# EAGLE design Adafruit DS3231 RTC Breakout (EAGLE 6.6.0)
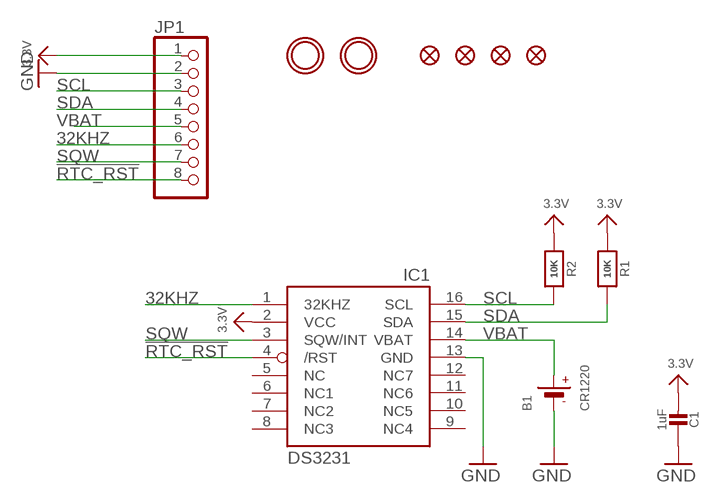
[diagram p0: schematic, sheet 1]

## Parts
B1  CR1220  BATTERYCR1220_SMT  [CR1220]
C1  1uF  CAP_CERAMIC0805-NOOUTLINE  [0805-NO]
FID1  FIDUCIAL""  [FIDUCIAL_1MM]
FID2  FIDUCIAL""  [FIDUCIAL_1MM]
FID3  FIDUCIAL""  [FIDUCIAL_1MM]
FID4  FIDUCIAL""  [FIDUCIAL_1MM]
IC1  DS3231/SO  [SO16W]
JP1  HEADER-1X870MIL  [1X08_ROUND_70]
R1  10K  RESISTOR0805_NOOUTLINE  [0805-NO]
R2  10K  RESISTOR0805_NOOUTLINE  [0805-NO]
U$6  MOUNTINGHOLE2.5  [MOUNTINGHOLE_2.5_PLATED]
U$7  MOUNTINGHOLE2.5  [MOUNTINGHOLE_2.5_PLATED]

## Nets
3.3V: C1.2 IC1.2(VCC) JP1.1 R1.1 R2.1
32KHZ: IC1.1(32KHZ) JP1.6
!RTC_RST: IC1.4(/RST) JP1.8
GND: B1.- C1.1 IC1.13(GND) JP1.2
SCL: IC1.16(SCL) JP1.3 R2.2
SDA: IC1.15(SDA) JP1.4 R1.2
SQW: IC1.3(SQW/INT) JP1.7
VBAT: B1.+$1(+) IC1.14(VBAT) JP1.5
Unconnected: IC1.5(NC) IC1.6(NC1) IC1.7(NC2) IC1.8(NC3) IC1.9(NC4) IC1.10(NC5) IC1.11(NC6) IC1.12(NC7)

## Library data of the parts
B1 = microbuilder:BATTERY: CR1220 SMT - Digikey: 3001K-ND CD2032 BAT-HLD-001 - Digikey: BAT-HLD-001-ND
C1 = microbuilder:CAP_CERAMIC: Ceramic Capacitors For new designs, use the packages preceded by an '_' character since they are more reliable: The following footprints should be used on most boards: _0402 - Standard footprint for regular board layouts _0603 - Standard footprint for regular board layouts _0805 - Standard footprint for regular board layouts _1206 - Standard footprint for regular board layouts For extremely tight-pitch boards where space is at a premium, the following 'micro-pitch' footprints can be used (smaller pads, no silkscreen outline, etc.): _0402MP - Micro-pitch footprint for very dense/compact boards _0603MP - Micro-pitch footprint for very dense/compact boards _0805MP - Micro-pitch footprint for very dense/compact boards _1206MP - Micro-pitch footprint for very dense/compact boards
FID1-FID4 = microbuilder:FIDUCIAL: Fiducial Alignment Points Various fiducial points for machine vision alignment.; BOM: EXCLUDE
IC1 = adafruit:DS3231
JP1 = microbuilder:HEADER-1X8: PIN HEADER
R1 R2 = microbuilder:RESISTOR: Resistors For new designs, use the packages preceded by an '_' character since they are more reliable: The following footprints should be used on most boards: _0402 - Standard footprint for regular board layouts _0603 - Standard footprint for regular board layouts _0805 - Standard footprint for regular board layouts _1206 - Standard footprint for regular board layouts For extremely tight-pitch boards where space is at a premium, the following 'micro-pitch' footprints can be used (smaller pads, no silkscreen outline, etc.): _0402MP - Micro-pitch footprint for very dense/compact boards _0603MP - Micro-pitch footprint for very dense/compact boards _0805MP - Micro-pitch footprint for very dense/compact boards _1206MP - Micro-pitch footprint for very dense/compact boards
U$6 U$7 = microbuilder:MOUNTINGHOLE: Mounting Hole For #2 screws (0.086"/2.18mm width, 0.094"/2.4mm hole) use 2.5mm; BOM: EXCLUDE

## Board
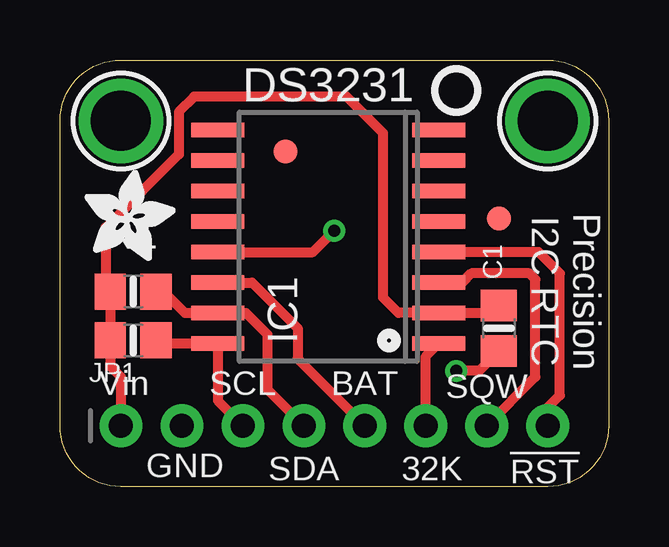
[diagram p1: board, top side]
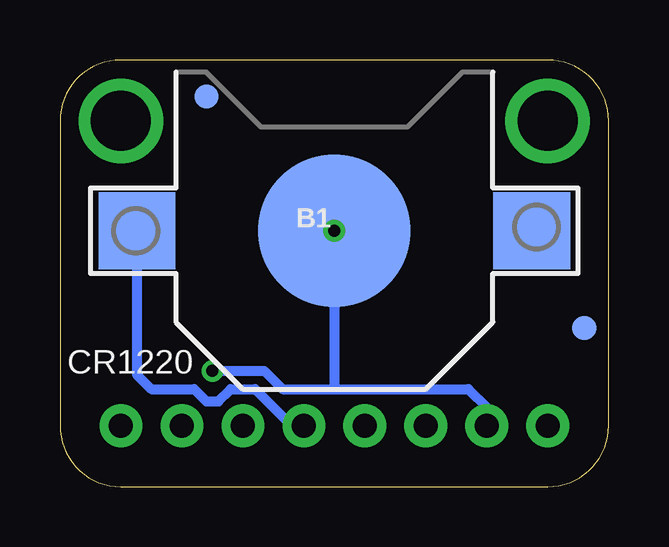
[diagram p2: board, bottom side, seen from below]

Size 22.86 x 17.78 mm. Coordinates in mm from the lower left corner, seen from the top.
Outline: 2.54,17.78 20.32,17.78 arc-90 22.86,15.24 22.86,2.54 arc-90 20.32,0 2.54,0 arc-90 0,2.54 0,15.24 arc-90 2.54,17.78
Copper layers (1*16): Top 0.035mm / dielectric 1.5mm / Bottom 0.035mm
Design rules "adafruit": minimum track width 8mil, minimum drill 15.5mil, track to track 8mil, track to pad 8mil, pad to pad 8mil, via to via 8mil, smd to smd 8mil, copper to edge 10mil, drill to drill 8mil, minimum pad ring 10mil, minimum via ring 8mil, stop-mask expansion 2mil, vias tented up to drill 20mil, thermal gap 10mil

### Footprints (pad centres in the part's own frame; a part is rotated, then mirrored left to right if it is on the bottom)
CR1220 = smd 3.2 x 3.2: +$1 -8.225,0; +$2 8.225,0 | smd 6.35 x 6.35: - 0,0
0805-NO = smd 1.3 x 1.5: 1 -0.95,0; 2 0.95,0
FIDUCIAL_1MM = smd 1 x 1: 1 0,0
SO16W = smd 0.6 x 2.2: 1 -4.445,-4.6; 2 -3.175,-4.6; 3 -1.905,-4.6; 4 -0.635,-4.6; 5 0.635,-4.6; 6 1.905,-4.6; 7 3.175,-4.6; 8 4.445,-4.6; 9 4.445,4.6; 10 3.175,4.6; 11 1.905,4.6; 12 0.635,4.6; 13 -0.635,4.6; 14 -1.905,4.6; 15 -3.175,4.6; 16 -4.445,4.6
1X08_ROUND_70 = drill 1 pad 1.778: 1 -8.89,0; 2 -6.35,0; 3 -3.81,0; 4 -1.27,0; 5 1.27,0; 6 3.81,0; 7 6.35,0; 8 8.89,0
MOUNTINGHOLE_2.5_PLATED = drill 2.5 pad 3.2: P$1 0,0

### Placement (x,y rotation side)
B1  11.43,10.67 0 bottom
C1  18.29,6.6 90 top
FID1  9.4,13.97 0 top
FID2  1.02,6.6 0 bottom
FID3  18.29,11.18 0 top
FID4  16.76,16.26 0 bottom
IC1  11.18,10.41 90 top
JP1  11.43,2.54 0 top
R1  3.05,8.13 0 top
R2  3.05,6.1 0 top
U$6  20.32,15.24 0 top
U$7  2.54,15.24 0 top
U$8  [ADAFRUIT_3.5MM]  1.02,9.4 0 top
U$9  [PCBFEAT-REV-040]  16.51,16.51 0 top

### Tracks (layer width: path | path; a pad name or v marks a point on that pad's centre or on a via)
3.3V
  Top 0.406: C1.2 18.09,7.24 IC1.2 14.1,7.24 13.46,7.87 13.46,14.73 11.94,16.26 5.59,16.26 4.95,15.62 4.95,13.84 1.91,10.79 1.91,8.32 R1.1 R2.1 2.1,5.01 2.54,4.57 JP1.1
32KHZ
  Top 0.406: JP1.6 15.24,5.43 IC1.1
!RTC_RST
  Top 0.406: JP1.8 20.32,3.3 20.83,3.81 20.83,8.89 19.94,9.78 IC1.4
GND  (via drill 0.5)
  Top 0.406: IC1.13 10.54,9.78 B1.- | C1.1 17.46,4.83 v16.51,4.83
  Bottom 0.406: 11.94,8.89 11.94,10.67 B1.- 11.43,4.06 | JP1.2 5.08,3.3 5.84,4.06 11.43,4.06 | v16.51,4.83 14.35,4.83 13.59,4.06 11.43,4.06
  other vias: 11.43,10.67
SCL
  Top 0.406: JP1.3 6.58,3.58 IC1.16 4.12,5.97 R2.2
SDA
  Top 0.406: JP1.4 8.64,4.06 8.64,6.35 7.75,7.24 IC1.15 5.21,7.24 4.32,8.13 R1.2
SQW
  Top 0.406: JP1.7 19.81,4.57 19.81,8.64 19.56,8.89 17.14,8.89 16.76,8.51 IC1.3
VBAT
  Top 0.406: IC1.14 8,8.51 9.91,6.6 9.91,5.33 JP1.5
  Bottom 0.406: B1.+$1 19.66,4.67 19.05,4.06 17.27,4.06 16.76,3.56 16.26,3.56 15.75,4.06 14.73,4.06 13.21,2.54 JP1.5

### Text on the board
tPlace: DS3231 | Precision / I2C RTC | Vin | SCL | BAT | SQW | GND | SDA | 32K | !RST
bPlace: CR1220